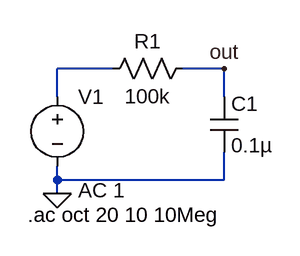
[diagram p0: schematic AC.asc]
AC.asc, the LTspice schematic file:
Version 4
SHEET 1 880 680
WIRE 96 96 32 96
WIRE 224 96 176 96
WIRE 32 128 32 96
WIRE 224 128 224 96
WIRE 32 224 32 208
WIRE 224 224 224 192
WIRE 224 224 32 224
WIRE 32 240 32 224
FLAG 32 240 0
FLAG 224 96 out
SYMBOL res 192 80 R90
WINDOW 0 0 56 VBottom 2
WINDOW 3 32 56 VTop 2
SYMATTR InstName R1
SYMATTR Value 100k
SYMBOL cap 208 128 R0
SYMATTR InstName C1
SYMATTR Value 0.1µ
SYMBOL voltage 32 112 R0
WINDOW 123 24 124 Left 2
WINDOW 39 0 0 Left 0
SYMATTR InstName V1
SYMATTR Value ""
SYMATTR Value2 AC 1
TEXT -2 264 Left 2 !.ac oct 20 10 10Meg

The netlist it stands for:
* AC.asc
R1 out N001 100k
C1 out 0 0.1µ
V1 N001 0 AC 1
.ac oct 20 10 10Meg
.backanno
.end